# Altium schematic sheet Carrier_Cancellation_HP.SchDoc
size B; SheetNumber: 6; SheetTotal: 12; PageSetup: Record=PageOptions|CenterHorizontal=True|CenterVertical=True|PrintScale=0.97|XCorrection=1.00|YCorrection=1.00|PrintKind=0|BorderSize=5000000|LeftOffset=0|BottomOffset=0|Orientation=2|PaperLength=1000|PaperWidth=1000|Scale=100|PaperSource=7|PrintQuality=-4|MediaType=1|DitherType=10|PaperKind=A4|PrintScaleMode=1
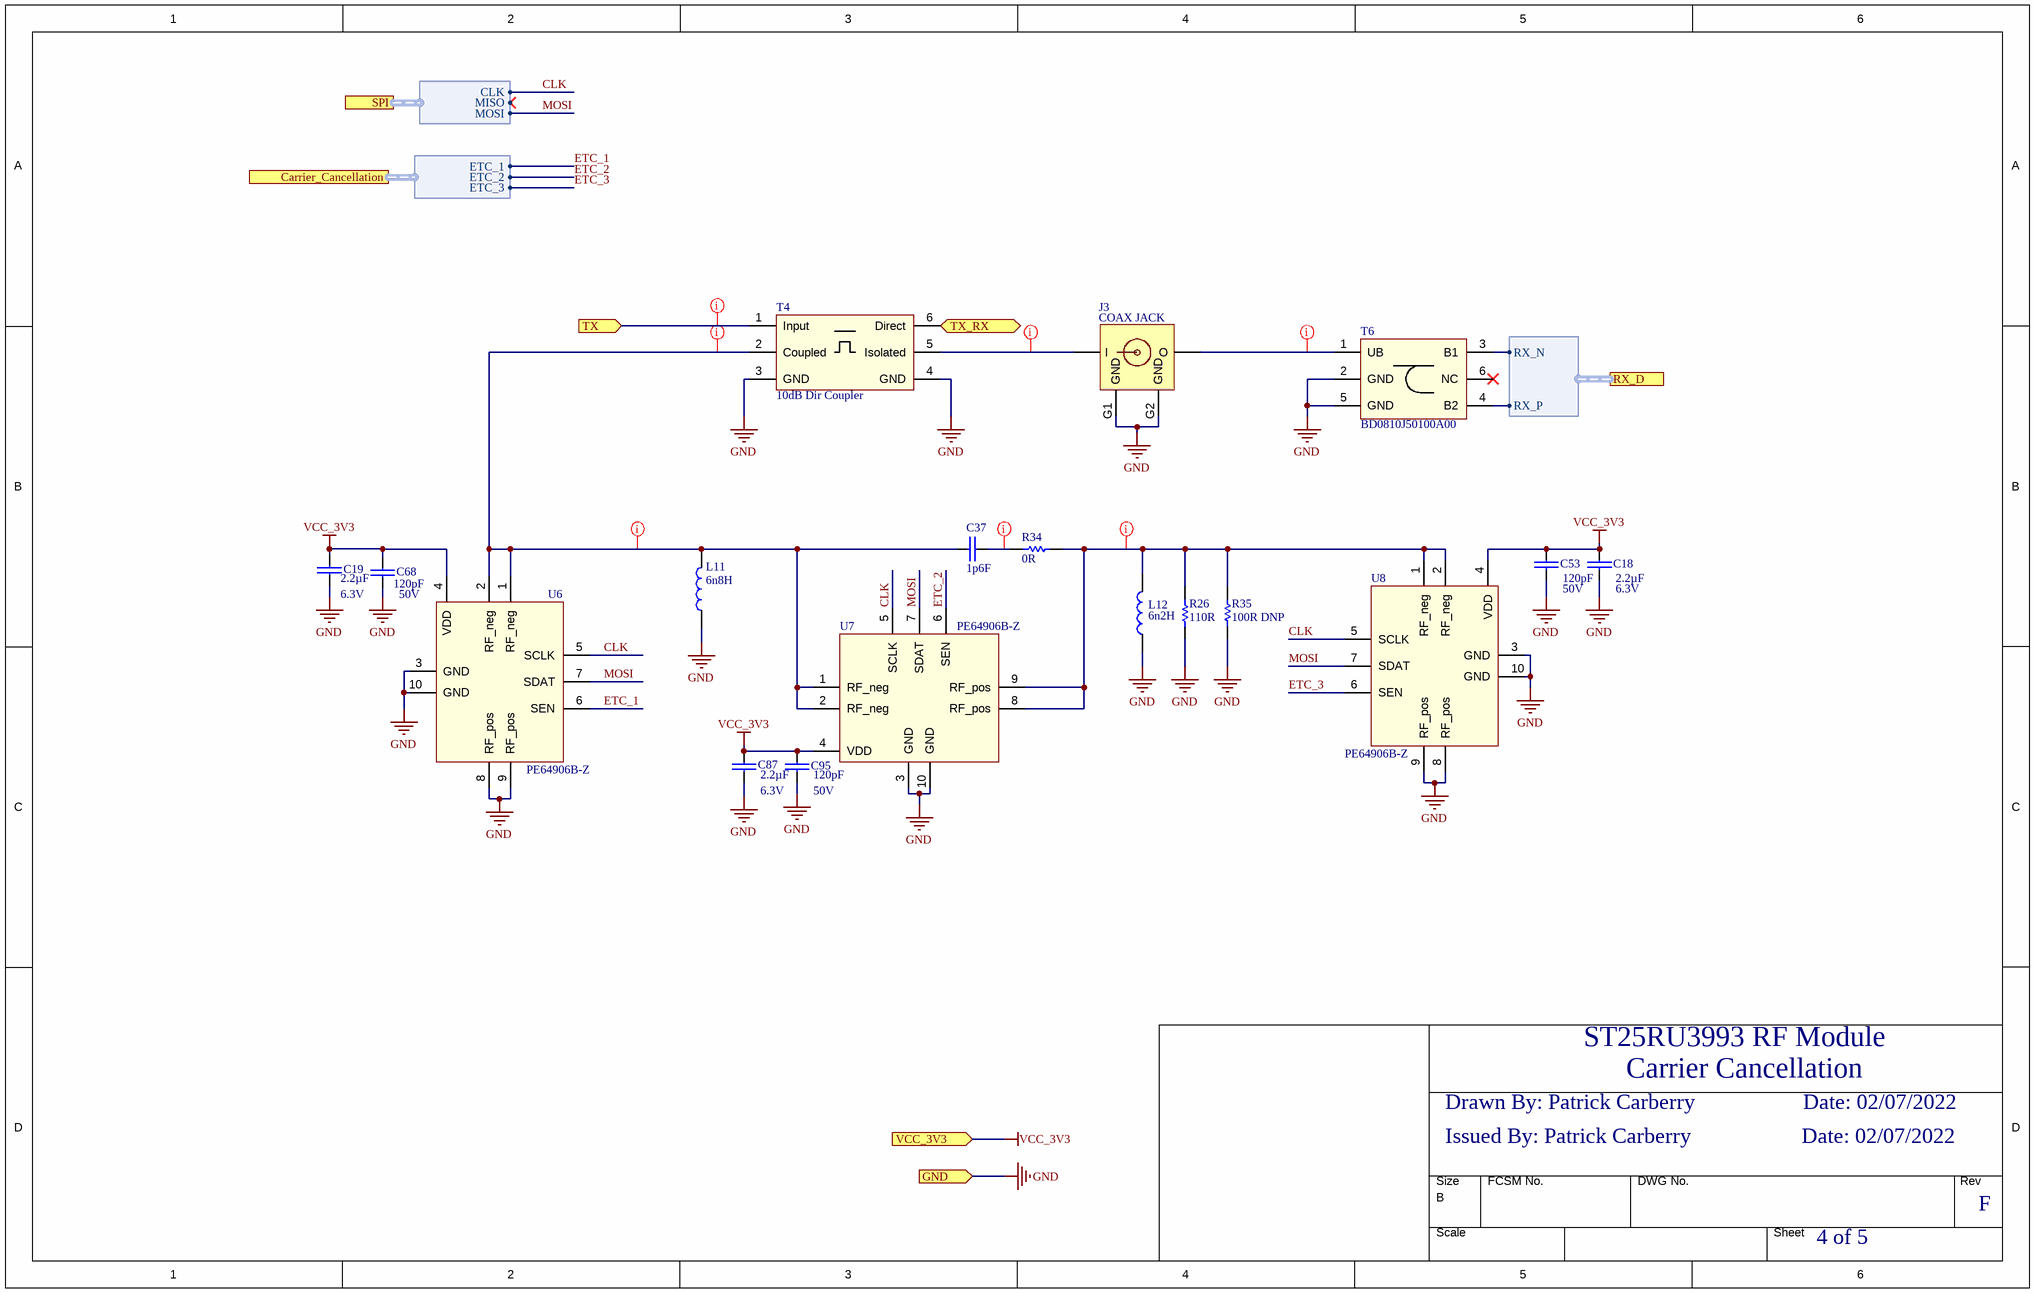
[diagram p0: Carrier_Cancellation_HP.SchDoc]

## Parts
C18  Capacitance: 2.2µF  Voltage - Rated: 6.3V  [C0402-RF]  (hidden comment: C0402C225K9PAC7867)
C19  Capacitance: 2.2µF  Voltage - Rated: 6.3V  [C0402-RF]  (hidden comment: C0402C225K9PAC7867)
C37  1p6F  [C0402-RF]
C53  value 120pF  Voltage: 50V  [C0402-RF]  (hidden comment: C0402C121J5GACAUTO)
C68  value 120pF  Voltage: 50V  [C0402-RF]  (hidden comment: C0402C121J5GACAUTO)
C87  Capacitance: 2.2µF  Voltage - Rated: 6.3V  [C0402-RF]  (hidden comment: C0402C225K9PAC7867)
C95  value 120pF  Voltage: 50V  [C0402-RF]  (hidden comment: C0402C121J5GACAUTO)
J3  COAX JACK  [MS-156HF]
L11  6n8H  [L0402-RF]
L12  6n2H  [L0402-RF]
R26  110R  [R0402-RF]
R34  0R  [R0402-RF]
R35  100R DNP  [R0402-RF]  (no BOM)
T4  10dB Dir Coupler  [DC0710J5010AHF]
T6  BD0810J50100A00  [BD0810J50100AHF]
U6  PE64906B-Z  [PE62304]
U7  PE64906B-Z  [PE62304]
U8  PE64906B-Z  [PE62304]

## Ports
Carrier_Cancellation (harness Harness_CC), GND (in), RX_D (harness Harness_RX_D), SPI (harness Harness_SPI), TX (in), TX_RX (bidir), VCC_3V3 (in)

## Harnesses
Harness_RX_D: RX_P, RX_N
Harness_CC: ETC_1, ETC_2, ETC_3
Harness_SPI: MISO, MOSI, CLK

## Nets
GND: C18.2 C19.2 C53.2 C68.2 C87.2 C95.2 J3.G1(GND) J3.G2(GND) L11.1 L12.1 R26.1 R35.1 T4.3(GND) T4.4(GND) T6.2(GND) T6.5(GND) U6.3(GND) U6.8(RF_pos) U6.9(RF_pos) U6.10(GND) U7.3(GND) U7.10(GND) U8.3(GND) U8.8(RF_pos) U8.9(RF_pos) U8.10(GND) ; port GND
VCC_3V3: C18.1 C19.1 C53.1 C68.1 C87.1 C95.1 U6.4(VDD) U7.4(VDD) U8.4(VDD) ; port VCC_3V3
CLK: U6.5(SCLK) U7.5(SCLK) U8.5(SCLK) ; port SPI.CLK
ETC_1: U6.6(SEN) ; port Carrier_Cancellation.ETC_1
ETC_2: U7.6(SEN) ; port Carrier_Cancellation.ETC_2
ETC_3: U8.6(SEN) ; port Carrier_Cancellation.ETC_3
MOSI: U6.7(SDAT) U7.7(SDAT) U8.7(SDAT) ; port SPI.MOSI
TX: T4.1(Input) ; port TX
TX_RX: T4.6(Direct) ; port TX_RX
NetC37_1: C37.1 L11.2 T4.2(Coupled) U6.1(RF_neg) U6.2(RF_neg) U7.1(RF_neg) U7.2(RF_neg)
NetC37_2: C37.2 R34.1
NetJ3_IN: J3.IN(I) T4.5(Isolated)
NetJ3_OUT: J3.OUT(O) T6.1(UB)
NetL12_2: L12.2 R26.2 R34.2 R35.2 U7.8(RF_pos) U7.9(RF_pos) U8.1(RF_neg) U8.2(RF_neg)
NetT6_3: T6.3(B1) ; port RX_D.RX_N
NetT6_4: T6.4(B2) ; port RX_D.RX_P

Not connected (* = marked no-connect by the designer): T6 6(NC)*

## Layout directives
net class SE_CPWG: NetC37_1, NetC37_2, NetJ3_IN, NetJ3_OUT, NetL12_2, TX

## Notes on the sheet
- Drawn By: Patrick Carberry
- ST25RU3993 RF Module
- Carrier Cancellation
- Date: 02/07/2022
- Issued By: Patrick Carberry
- 4 of 5
- F

## Library data of the parts
C18 C19 C87 = CAP_2.2UF_6.3V_10%_X5R_0402: Manufacturer: KEMET; Tolerance: 10%; Temperature Coefficient: X5R; Thickness (Max): 0.014" (0.35mm); ComponentLink1URL: https://connect.kemet.com:7667/gateway/IntelliData-ComponentDocumentation/1.0/download/datasheet/C0402C225K9PACTU; ComponentLink1Description: http://www.murata.com/~/media/webrenewal/support/library/catalog/products/capacitor/mlcc/c02e.pdf; Manufacturer Part Number: C0402C225K9PAC7867
C37 = GRM1555C1H3R6BA01D: Manufacturer: Murata; Manufacturer Part Number: GRM1555C1H1R6BA01D; Capacitance: 1.6pF; Voltage Rating: 50V; Dielectric: C0G; Supplier 1: Digi-Key; Supplier Part Number 1: 490-6214-1-ND; Stock 1: 77555; RoHS: Yes; Mount: Surface Mount; Case/Package: 0402; Case Code (Metric): 1005; Case Code (Imperial): 0402; Min Operating Temperature: -55°C; Max Operating Temperature: 125°C; Package Quantity: 1; Packaging: Tape and Reel; Voltage Rating (DC): 50V; Termination: SMD/SMT; Length: 1mm; Height: 0.5mm; Width: 0.02inch; Thickness: 0.022inch; Depth: 0.5mm; Radiation Hardening: No; ComponentLink1URL: https://datasheet.ciiva.com/6270/grm1555c1h1r6ba01-01-6270912.pdf?src-supplier=Digi-Key; ComponentLink1Description: https://datasheet.ciiva.com/6270/grm1555c1h1r6ba01-01-6270912.pdf?src-supplier=Digi-Key; ComponentLink2URL: https://datasheet.ciiva.com/18184/getdatasheetpartid-319318-18184245.pdf?src-supplier=Verical; ComponentLink2Description: https://datasheet.ciiva.com/18184/getdatasheetpartid-319318-18184245.pdf?src-supplier=Verical; ComponentLink3URL: https://datasheet.ciiva.com/11615/product-11615783.pdf?src-supplier=Avnet; ComponentLink3Description: https://datasheet.ciiva.com/11615/product-11615783.pdf?src-supplier=Avnet; ComponentLink4URL: https://datasheet.ciiva.com/5438/product-5438044.pdf?src-supplier=Mouser; ComponentLink4Description: https://datasheet.ciiva.com/5438/product-5438044.pdf?src-supplier=Mouser; ComponentLink5URL: https://datasheet.ciiva.com/6270/partnumbering-e-01-6270909.pdf?src-supplier=Digi-Key; ComponentLink5Description: https://datasheet.ciiva.com/6270/partnumbering-e-01-6270909.pdf?src-supplier=Digi-Key
C53 C68 C95 = CAP_120PF_50V_5%_C0G_0402: CAP CER 120PF 50V C0G/NP0 0402; Manufacturer: KEMET; Manufacturer Part Number: C0402C121J5GACAUTO; ComponentLink1URL: https://content.kemet.com/datasheets/KEM_C1022_C0G_AUTO_SMD.pdf; ComponentLink1Description: http://search.murata.co.jp/Ceramy/image/img/A01X/G101/ENG/GRM0335C1H121JA01-01.pdf
J3 = MS-156HF: CONN COAX JACK STR 50 OHM SMD; Manufacturer 1: Hirose Electric Co Ltd; Manufacturer Part Number 1: MS-156HF(01); Connector Style: Coaxial Switch - 4mm Plug Dia; Connector Type: Receptacle, Female Socket; Contact Termination: Solder; Impedance: 50 Ohm; Frequency - Max: 6GHz; Body Material: Phosphor Bronze; Body Finish: Gold; Center Contact Material: Beryllium Copper; Dielectric Material: Polyamide (PA), Nylon 6T; Coupler Type: Standard; Frequency: 700MHz ~ 1GHz; Coupling Factor: 10.9dB; Insertion Loss: 0.21dB; Power - Max: 2W; Return Loss: 17.5dB; Exact Component Match: no; Supplier 1: Digi-Key; Supplier Part Number 1: H11669-ND; RoHS: RoHS Compliant; Category: Connectors, Interconnects; Stock 1: 10; Pricing 1: 1=0.84, 10=0.735, 25=0.6912, 50=0.6626, 100=0.6337, 250=0.57612, 500=0.51852, 1000=0.4609, 2500=0.41769 (EUR); Packaging: Bulk; Part Status: Active; Shield Termination: Solder; Mounting Type: Surface Mount; Cable Group: -; Fastening Type: Snap-On; Features: Internal Switch; Housing Color: Gold; Ingress Protection: -; Center Contact Plating: Gold; Voltage Rating: -; Operating Temperature: -40°C ~ 85°C; ComponentLink1URL: https://www.hirose.com/product/en/download_file/key_name/MS-156HF/category/Catalog/doc_file_id/49714/?file_category_id=4&item_id=394&is_series=1; ComponentLink1Description: https://www.hirose.com/product/en/download_file/key_name/MS-156HF/category/Catalog/doc_file_id/49714/?file_category_id=4&item_id=394&is_series=1; Supplier 2: Digi-Key; Supplier Part Number 2: 1173-1084-1-ND; Manufacturer 2: Anaren; Manufacturer Part Number 2: DC0710J5010AHF; Stock 2: 8788; Pricing 2: 1=0.82, 10=0.735, 25=0.648, 100=0.5833, 250=0.50772, 500=0.4537 (EUR); Applications: General Purpose; Isolation: -; Package / Case: 0805 (2012 Metric); Supplier Device Package: 0805; ComponentLink2URL: https://www.anaren.com/sites/default/files/Part-Datasheets/DC0710J5010AHF_Datasheet_RevA.pdf; ComponentLink2Description: https://www.anaren.com/sites/default/files/Part-Datasheets/DC0710J5010AHF_Datasheet_RevA.pdf; Manufacturer: Hirose Electric Co Ltd; Manufacturer Part Number: MS-156HF(01)
L11 = LQW15AN6N8G00D: FIXED IND 6.8NH 700MA 90 MOHM; Manufacturer: Murata Electronics North America; Type: Wirewound; Material - Core: Non-Magnetic; Tolerance: ±2%; Shielding: Unshielded; DC Resistance (DCR): 90 mOhm Max; Q @ Freq: 25 @ 250MHz; Exact Component Match: yes; Supplier 1: Digi-Key; Manufacturer Part Number: LQW15AN6N8G00D; RoHS: RoHS Compliant; Category: Inductors, Coils, Chokes; Stock: 89299; Pricing 1: 1=0.16, 10=0.145, 100=0.0967, 500=0.08054, 1000=0.06765, 2500=0.05798 (EUR); Packaging: Cut Tape (CT); Part Status: Active; Ratings: -; Operating Temperature: -55°C ~ 125°C; Mounting Type: Surface Mount; Package / Case: Nonstandard; Supplier Device Package: 0402 (1005 Metric); Size / Dimension: 0.039" L x 0.020" W (1.00mm x 0.50mm); Height - Seated (Max): 0.024" (0.60mm); ComponentLink1URL: http://search.murata.co.jp/Ceramy/image/img/P02/JELF243A-0050.pdf; ComponentLink1Description: http://search.murata.co.jp/Ceramy/image/img/P02/JELF243A-0050.pdf; Supplier Part Number 1: 490-6840-1-ND
L12 = LQW15AN5N6C10D: Inductor RF Chip Wirewound 6.2nH 0.2nH 100MHz 25Q-Factor 700mA 90mOhm DCR 0402 T/R; Manufacturer: Murata; Manufacturer Part Number: LQW15AN6N2C00D; Core Material: Non-Magnetic,Air,Ferrite; Tolerance: 3%; Shielding: Unshielded; Q Factor: 25; DC Resistance (DCR): 90mR; Self Resonant Frequency: 8GHz; Current: 540mA; Supplier 1: Digi-Key; Supplier Part Number 1: 490-6839-1-ND; Stock 1: 20182; RoHS: Yes; Mount: Surface Mount; Case/Package: 0402; Number of Pins: 2; Weight: 2.8E-05oz; Case Code (Metric): 1005; Case Code (Imperial): 0402; Min Operating Temperature: -55°C; Max Operating Temperature: 125°C; Packaging: Tape and Reel; Package Quantity: 10000; Inductance: 6.2nH; Current Rating: 700mA; Composition: Wirewound; Test Frequency: 100MHz; Max DC Current: 700mA; Termination: SMD/SMT; DC Current: 700mA; Military Standard: Not; Length: 1mm; Height: 0.5mm; Width: 0.02inch; Height - Seated (Max): 0.024inch; Depth: 0.7mm; Radiation Hardening: No; REACH SVHC: No SVHC; Lead Free: Lead Free; ComponentLink1URL: https://datasheet.ciiva.com/11799/0900766b8090d800-11799065.pdf?src-supplier=RSComponents; ComponentLink1Description: https://datasheet.ciiva.com/11799/0900766b8090d800-11799065.pdf?src-supplier=RSComponents; ComponentLink2URL: https://datasheet.ciiva.com/4977/product-4977157.pdf?src-supplier=Mouser; ComponentLink2Description: https://datasheet.ciiva.com/4977/product-4977157.pdf?src-supplier=Mouser; ComponentLink3URL: https://datasheet.ciiva.com/16207/l0075s0080lqw15a-00-16207917.pdf?src-supplier=Future+Electronics; ComponentLink3Description: https://datasheet.ciiva.com/16207/l0075s0080lqw15a-00-16207917.pdf?src-supplier=Future+Electronics
R26 = ERJ-2RKF75R0X: RES SMD 110 OHM 1% 1/10W 0402; Manufacturer: Panasonic; Manufacturer Part Number: ERJ-2RKF1100X; Power Rating: 100mW; Voltage Rating: 50V; Temperature Coefficient: 100ppm/°C; Supplier 1: Digi-Key; Supplier Part Number 1: P110LCT-ND; Stock 1: 182558; RoHS: Yes; Mount: Surface Mount; Case/Package: 0402; Weight: 2.8E-05oz; Case Code (Imperial): 0402; Case Code (Metric): 1005; Contact Plating: Tin; Min Operating Temperature: -55°C; Max Operating Temperature: 155°C; Packaging: Tape and Reel; Resistance: 110R; Tolerance: 1%; Package Quantity: 1; Composition: Thick Film; Termination: SMD/SMT; Number of Terminations: 2; Military Standard: Not; Max Power Dissipation: 100mW; Voltage Rating (DC): 50V; Features: Automotive AEC-Q200; Length: 1mm; Height: 0.35mm; Width: 0.5mm; Depth: 0.5mm; REACH SVHC: Unknown; Lead Free: Lead Free; ComponentLink1URL: https://datasheet.ciiva.com/11821/0900766b80f80784-11821164.pdf?src-supplier=RSComponents; ComponentLink1Description: https://datasheet.ciiva.com/11821/0900766b80f80784-11821164.pdf?src-supplier=RSComponents; ComponentLink2URL: https://datasheet.ciiva.com/43460/426256-43460279.pdf?src-supplier=Farnell; ComponentLink2Description: https://datasheet.ciiva.com/43460/426256-43460279.pdf?src-supplier=Farnell; ComponentLink3URL: https://datasheet.ciiva.com/28593/1678782-28593210.pdf?src-supplier=Element14; ComponentLink3Description: https://datasheet.ciiva.com/28593/1678782-28593210.pdf?src-supplier=Element14; ComponentLink4URL: https://datasheet.ciiva.com/46388/426256-46388475.pdf?src-supplier=Element14; ComponentLink4Description: https://datasheet.ciiva.com/46388/426256-46388475.pdf?src-supplier=Element14; ComponentLink5URL: https://datasheet.ciiva.com/16757/70260748-16757813.pdf?src-supplier=Allied+Electronics; ComponentLink5Description: https://datasheet.ciiva.com/16757/70260748-16757813.pdf?src-supplier=Allied+Electronics; ComponentLink6URL: https://datasheet.ciiva.com/28665/1678782-28665365.pdf?src-supplier=Element14; ComponentLink6Description: https://datasheet.ciiva.com/28665/1678782-28665365.pdf?src-supplier=Element14; ComponentLink7URL: https://datasheet.ciiva.com/24163/aoa0000ce2-24163366.pdf?src-supplier=Mouser; ComponentLink7Description: https://datasheet.ciiva.com/24163/aoa0000ce2-24163366.pdf?src-supplier=Mouser; ComponentLink8URL: https://datasheet.ciiva.com/30259/aoa0000ce2-30259596.pdf?src-supplier=Onlinecomponents.com; ComponentLink8Description: https://datasheet.ciiva.com/30259/aoa0000ce2-30259596.pdf?src-supplier=Onlinecomponents.com
R34 = RC0402JR-070RL: RES SMD 0.0OHM JUMPER 1/16W 0402; Manufacturer: Yageo; Resistance (Ohms): 0.0; Power (Watts): 0.063W, 1/16W; Exact Component Match: no; Supplier 1: Digi-Key; Supplier Part Number 1: 311-0.0JRDKR-ND; Manufacturer Part Number: RC0402JR-070RL; RoHS: RoHS Compliant; Category: Resistors; Stock 1: 13423202; Pricing 1: 1=0.09, 10=0.012, 25=0.0084, 100=0.0048, 250=0.0036, 500=0.00288, 1000=0.00212, 2500=0.00184, 5000=0.00152 (EUR); Packaging: Digi-Reel®; Part Status: Active; Tolerance: Jumper; Composition: Thick Film; Features: Moisture Resistant; Temperature Coefficient: -; Operating Temperature: -55°C ~ 155°C; Package / Case: 0402 (1005 Metric); Supplier Device Package: 0402; Size / Dimension: 0.039" L x 0.020" W (1.00mm x 0.50mm); Height - Seated (Max): 0.016" (0.40mm); Number of Terminations: 2; Failure Rate: -; ComponentLink1URL: http://www.yageo.com/NewPortal/yageodocoutput?fileName=/pdf/R-Chip/PYu-RC_Group_51_RoHS_L_4.pdf; ComponentLink1Description: http://www.yageo.com/NewPortal/yageodocoutput?fileName=/pdf/R-Chip/PYu-RC_Group_51_RoHS_L_4.pdf; Manufacturer 1: Yageo; Manufacturer Part Number 1: RC0402JR-070RL
R35 = RC0402FR-07100RL: RES SMD 100 OHM 1% 1/16W 0402; Manufacturer: Yageo; Resistance (Ohms): 100; Power (Watts): 0.063W, 1/16W; Temperature Coefficient: ±100ppm/°C; Exact Component Match: no; Supplier 1: Digi-Key; Supplier Part Number 1: 311-100LRCT-ND; Manufacturer Part Number: RC0402FR-07100RL; RoHS: RoHS Compliant; Category: Resistors; Stock 1: 1895343; Pricing 1: 1=0.09, 10=0.012, 25=0.0088, 100=0.0049, 250=0.00372, 500=0.00296, 1000=0.00218, 2500=0.00189, 5000=0.00156 (EUR); Packaging: Cut Tape (CT); Part Status: Active; Tolerance: ±1%; Composition: Thick Film; Features: Moisture Resistant; Operating Temperature: -55°C ~ 155°C; Package / Case: 0402 (1005 Metric); Supplier Device Package: 0402; Size / Dimension: 0.039" L x 0.020" W (1.00mm x 0.50mm); Height - Seated (Max): 0.016" (0.40mm); Number of Terminations: 2; Failure Rate: -; ComponentLink1URL: http://www.yageo.com/NewPortal/yageodocoutput?fileName=/pdf/R-Chip/PYu-RC_Group_51_RoHS_L_4.pdf; ComponentLink1Description: http://www.yageo.com/NewPortal/yageodocoutput?fileName=/pdf/R-Chip/PYu-RC_Group_51_RoHS_L_4.pdf; Manufacturer 1: Yageo; Manufacturer Part Number 1: RC0402FR-07100RL
T4 = DC0710J5010AHF: Directional Coupler; Manufacturer: Anaren; Coupler Type: Standard; Frequency: 700MHz ~ 1GHz; Coupling Factor: 10.9dB; Insertion Loss: 0.21dB; Power - Max: 2W; Return Loss: 17.5dB; Exact Component Match: no; Supplier 1: Digi-Key; Supplier Part Number 1: 1173-1084-1-ND; Manufacturer Part Number: DC0710J5010AHF; RoHS: RoHS Compliant; Category: RF/IF and RFID; Stock: 28051; Pricing: 1=0.74, 10=0.654, 25=0.5904, 100=0.5167, 250=0.45344, 500=0.4007 (EUR); Packaging: Cut Tape (CT); Part Status: Active; Applications: General Purpose; Isolation: -; Package / Case: 0805 (2012 Metric); Supplier Device Package: 0805; ComponentLink1URL: https://cdn.anaren.com/product-documents/Xinger/DirectionalCouplers/DC0710J5010AHF/DC0710J5010AHF_DataSheet(Rev_B).pdf; ComponentLink1Description: https://cdn.anaren.com/product-documents/Xinger/DirectionalCouplers/DC0710J5010AHF/DC0710J5010AHF_DataSheet(Rev_B).pdf
T6 = BD0810J50100AHF: XFRMR BALUN RF 800-1000MHZ 0805; Manufacturer: Anaren; Frequency Range: 800MHz ~ 1GHz; Impedance - Unbalanced/Balanced: 50 / 100 Ohm; Phase Difference: 1°; Insertion Loss (Max): 0.95dB; Return Loss (Min): 13dB; Exact Component Match: no; Supplier Part Number 1: 1173-1056-2-ND; Supplier Part Number 2: 1173-1056-1-ND; Manufacturer Part Number: BD0810J50100AHF; RoHS: RoHS Compliant; Category: RF/IF and RFID; Stock: 9830; Pricing: 1=0.6, 10=0.587, 25=0.3928, 50=0.3494, 100=0.3201, 250=0.28724, 500=0.28124 (EUR); Packaging: Cut Tape (CT); Part Status: Active; Package / Case: 0805 (2012 Metric); Mounting Type: Surface Mount; ComponentLink1URL: https://cdn.anaren.com/product-documents/Xinger/BalunTransformers/BD0810J50100AHF/BD0810J50100AHF_DataSheet(Rev_E).pdf; ComponentLink1Description: https://cdn.anaren.com/product-documents/Xinger/BalunTransformers/BD0810J50100AHF/BD0810J50100AHF_DataSheet(Rev_E).pdf; Supplier 1: Digi-Key
U6-U8 = PE64906MLAA-Z: IC RF DTC 100-3000MHZ 10QFN; Manufacturer: Peregrine Semiconductor; Function: Digitally Tunable Capacitor; Frequency: 100MHz ~ 3GHz; RF Type: General Purpose; Secondary Attributes: SPI Interface; Exact Component Match: yes; Frequency - Lower: 500MHz; Isolation @ Frequency: 20dB @ 5.8GHz (typ); Insertion Loss @ Frequency: 0.8dB @ 5.8GHz; IIP3: 57dBm (typ); Circuit: SPDT; P1dB: 36dBm; Impedance: 50 Ohm; Voltage - Supply: 2.5 V ~ 5 V; Manufacturer Part Number: PE64906B-Z; RoHS: RoHS Compliant; Category: RF/IF and RFID; Packaging: Cut Tape (CT); Package / Case: 10-UFQFN Exposed Pad; ComponentLink1URL: http://www.psemi.com/pdf/datasheets/pe64906ds.pdf; ComponentLink1Description: http://www.psemi.com/pdf/datasheets/pe64906ds.pdf; Topology: -; Features: -; Operating Temperature: -40°C ~ 85°C; ComponentLink2URL: http://www.skyworksinc.com/uploads/documents/SKY13431_374LF_201649C.pdf; ComponentLink2Description: http://www.skyworksinc.com/uploads/documents/SKY13431_374LF_201649C.pdf